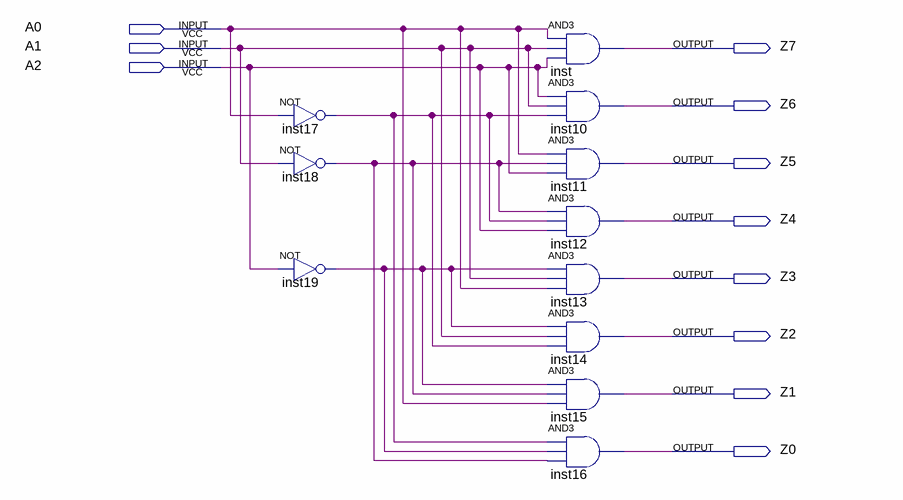
[diagram p0: schematic sheet]
// Quartus schematic three.bdf as structural Verilog: 11 symbols, 11 pins
module three (
  input  A0,
  input  A1,
  input  A2,
  output Z7,
  output Z6,
  output Z5,
  output Z4,
  output Z3,
  output Z2,
  output Z1,
  output Z0
);

  wire inst17_out, inst18_out, inst19_out;

  not inst17 (inst17_out, A0);
  not inst18 (inst18_out, A1);
  not inst19 (inst19_out, A2);
  and inst (Z7, A0, A1, A2);
  and inst10 (Z6, A2, A1, inst17_out);
  and inst11 (Z5, A0, inst18_out, A2);
  and inst12 (Z4, inst18_out, inst17_out, A2);
  and inst13 (Z3, inst19_out, A1, A0);
  and inst14 (Z2, inst19_out, A1, inst17_out);
  and inst15 (Z1, inst19_out, inst18_out, A0);
  and inst16 (Z0, inst17_out, inst19_out, inst18_out);
endmodule
